# EAGLE design McPiFace-RGBPanel-V2 (EAGLE 7.4.0)
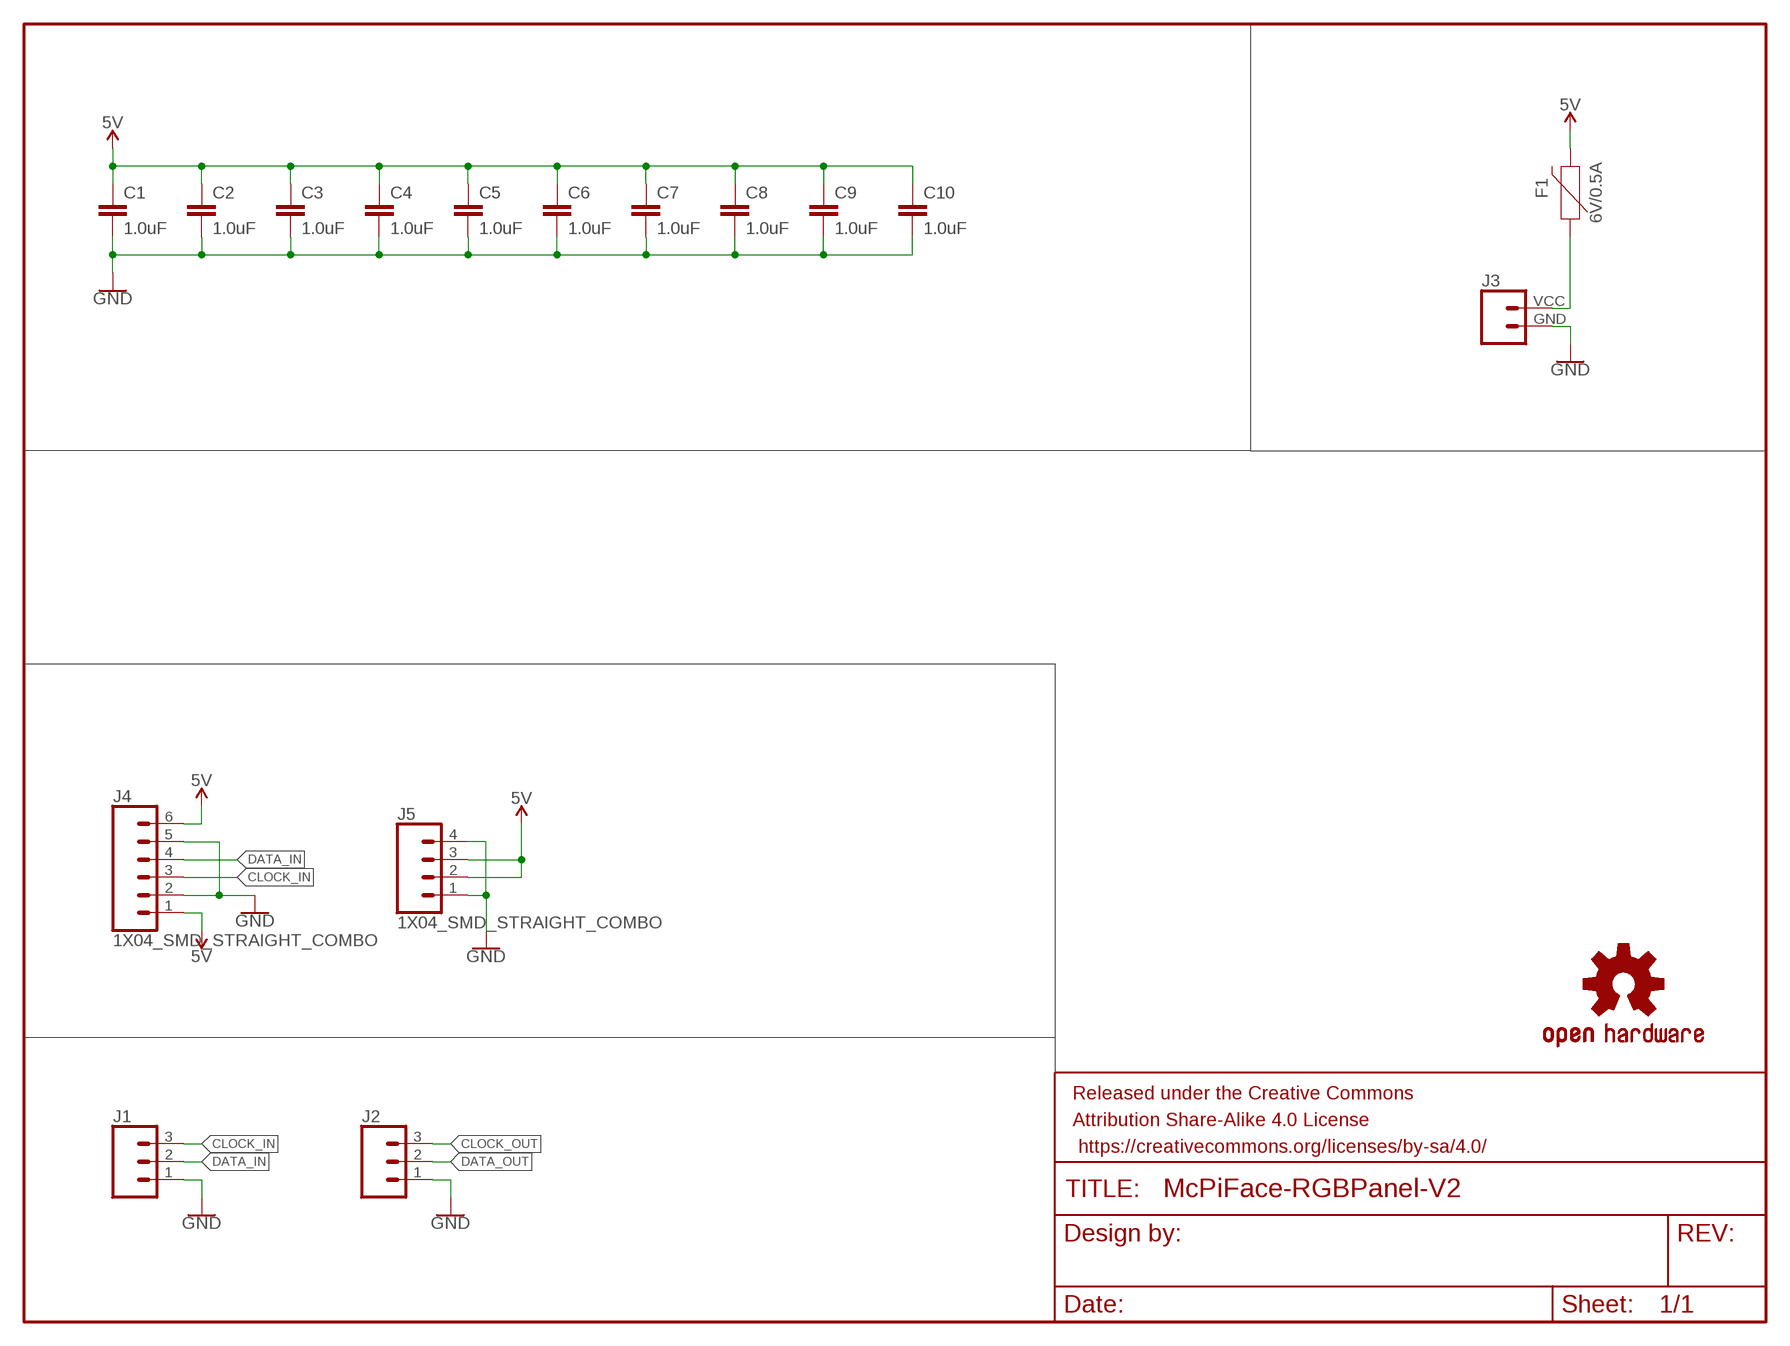
[diagram p0: schematic, sheet 1, part 1 of 2]
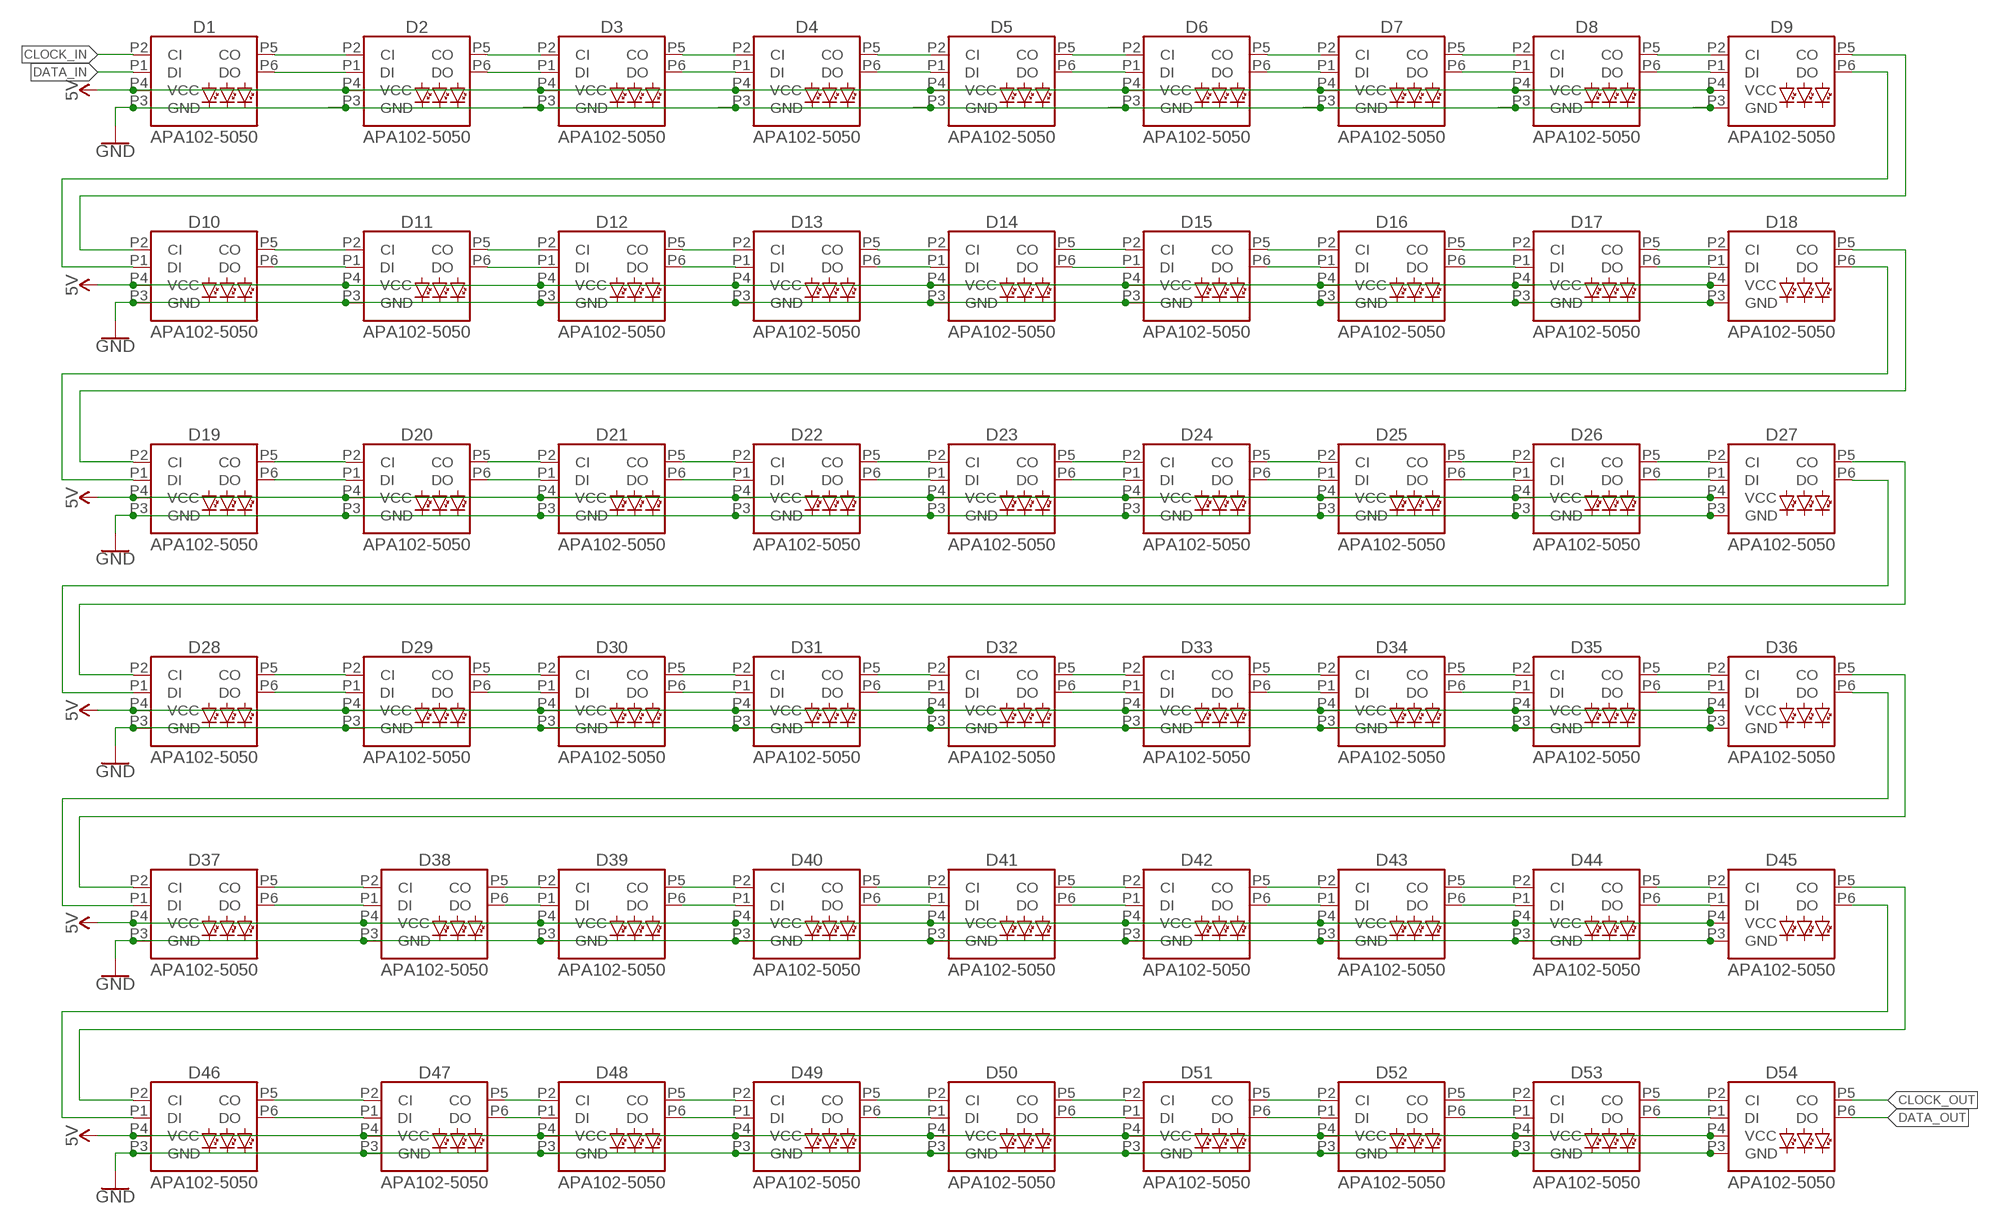
[diagram p1: schematic, sheet 1, part 2 of 2]

## Parts
C1  1.0uF  1.0UF-25V-+80/-20(0805)"  [0805-CAP]
C2  1.0uF  1.0UF-25V-+80/-20(0805)"  [0805-CAP]
C3  1.0uF  1.0UF-25V-+80/-20(0805)"  [0805-CAP]
C4  1.0uF  1.0UF-25V-+80/-20(0805)"  [0805-CAP]
C5  1.0uF  1.0UF-25V-+80/-20(0805)"  [0805-CAP]
C6  1.0uF  1.0UF-25V-+80/-20(0805)"  [0805-CAP]
C7  1.0uF  1.0UF-25V-+80/-20(0805)"  [0805-CAP]
C8  1.0uF  1.0UF-25V-+80/-20(0805)"  [0805-CAP]
C9  1.0uF  1.0UF-25V-+80/-20(0805)"  [0805-CAP]
C10  1.0uF  1.0UF-25V-+80/-20(0805)"  [0805-CAP]
D1  APA102-5050  [APA102-5050]
D2  APA102-5050  [APA102-5050]
D3  APA102-5050  [APA102-5050]
D4  APA102-5050  [APA102-5050]
D5  APA102-5050  [APA102-5050]
D6  APA102-5050  [APA102-5050]
D7  APA102-5050  [APA102-5050]
D8  APA102-5050  [APA102-5050]
D9  APA102-5050  [APA102-5050]
D10  APA102-5050  [APA102-5050]
D11  APA102-5050  [APA102-5050]
D12  APA102-5050  [APA102-5050]
D13  APA102-5050  [APA102-5050]
D14  APA102-5050  [APA102-5050]
D15  APA102-5050  [APA102-5050]
D16  APA102-5050  [APA102-5050]
D17  APA102-5050  [APA102-5050]
D18  APA102-5050  [APA102-5050]
D19  APA102-5050  [APA102-5050]
D20  APA102-5050  [APA102-5050]
D21  APA102-5050  [APA102-5050]
D22  APA102-5050  [APA102-5050]
D23  APA102-5050  [APA102-5050]
D24  APA102-5050  [APA102-5050]
D25  APA102-5050  [APA102-5050]
D26  APA102-5050  [APA102-5050]
D27  APA102-5050  [APA102-5050]
D28  APA102-5050  [APA102-5050]
D29  APA102-5050  [APA102-5050]
D30  APA102-5050  [APA102-5050]
D31  APA102-5050  [APA102-5050]
D32  APA102-5050  [APA102-5050]
D33  APA102-5050  [APA102-5050]
D34  APA102-5050  [APA102-5050]
D35  APA102-5050  [APA102-5050]
D36  APA102-5050  [APA102-5050]
D37  APA102-5050  [APA102-5050]
D38  APA102-5050  [APA102-5050]
D39  APA102-5050  [APA102-5050]
D40  APA102-5050  [APA102-5050]
D41  APA102-5050  [APA102-5050]
D42  APA102-5050  [APA102-5050]
D43  APA102-5050  [APA102-5050]
D44  APA102-5050  [APA102-5050]
D45  APA102-5050  [APA102-5050]
D46  APA102-5050  [APA102-5050]
D47  APA102-5050  [APA102-5050]
D48  APA102-5050  [APA102-5050]
D49  APA102-5050  [APA102-5050]
D50  APA102-5050  [APA102-5050]
D51  APA102-5050  [APA102-5050]
D52  APA102-5050  [APA102-5050]
D53  APA102-5050  [APA102-5050]
D54  APA102-5050  [APA102-5050]
F1  6V/0.5A  PPTC_HALF-AMP  [1206]
FRAME1  FRAME-LETTER  [CREATIVE_COMMONS]
J1  CONN_03SMD  [1X03-1MM-RA]
J2  CONN_03SMD  [1X03-1MM-RA]
J3  CONN_02JST-2-PH-VERT  [JST-2-SMD-VERT]
J4  1X04_SMD_STRAIGHT_COMBO  CONN_06SMD-STRAIGHT-COMBO-FEMALE  [1X06_SMD_STRAIGHT_COMBO]
J5  1X04_SMD_STRAIGHT_COMBO  CONN_04SMD_STRAIGHT_COMBO  [1X04_SMD_VERTICAL_COMBO]
LOGO1  OSHW-LOGOL  [OSHW-LOGO-L]

## Nets
5V: C1.1 C2.1 C3.1 C4.1 C5.1 C6.1 C7.1 C8.1 C9.1 C10.1 D1.P4(VCC) D2.P4(VCC) D3.P4(VCC) D4.P4(VCC) D5.P4(VCC) D6.P4(VCC) D7.P4(VCC) D8.P4(VCC) D9.P4(VCC) D10.P4(VCC) D11.P4(VCC) D12.P4(VCC) D13.P4(VCC) D14.P4(VCC) D15.P4(VCC) D16.P4(VCC) D17.P4(VCC) D18.P4(VCC) D19.P4(VCC) D20.P4(VCC) D21.P4(VCC) D22.P4(VCC) D23.P4(VCC) D24.P4(VCC) D25.P4(VCC) D26.P4(VCC) D27.P4(VCC) D28.P4(VCC) D29.P4(VCC) D30.P4(VCC) D31.P4(VCC) D32.P4(VCC) D33.P4(VCC) D34.P4(VCC) D35.P4(VCC) D36.P4(VCC) D37.P4(VCC) D38.P4(VCC) D39.P4(VCC) D40.P4(VCC) D41.P4(VCC) D42.P4(VCC) D43.P4(VCC) D44.P4(VCC) D45.P4(VCC) D46.P4(VCC) D47.P4(VCC) D48.P4(VCC) D49.P4(VCC) D50.P4(VCC) D51.P4(VCC) D52.P4(VCC) D53.P4(VCC) D54.P4(VCC) F1.2 J4.1 J4.6 J5.2 J5.3
CLOCK_IN: D1.P2(CI) J1.3 J4.3
CLOCK_OUT: D54.P5(CO) J2.3
DATA_IN: D1.P1(DI) J1.2 J4.4
DATA_OUT: D54.P6(DO) J2.2
GND: C1.2 C2.2 C3.2 C4.2 C5.2 C6.2 C7.2 C8.2 C9.2 C10.2 D1.P3(GND) D2.P3(GND) D3.P3(GND) D4.P3(GND) D5.P3(GND) D6.P3(GND) D7.P3(GND) D8.P3(GND) D9.P3(GND) D10.P3(GND) D11.P3(GND) D12.P3(GND) D13.P3(GND) D14.P3(GND) D15.P3(GND) D16.P3(GND) D17.P3(GND) D18.P3(GND) D19.P3(GND) D20.P3(GND) D21.P3(GND) D22.P3(GND) D23.P3(GND) D24.P3(GND) D25.P3(GND) D26.P3(GND) D27.P3(GND) D28.P3(GND) D29.P3(GND) D30.P3(GND) D31.P3(GND) D32.P3(GND) D33.P3(GND) D34.P3(GND) D35.P3(GND) D36.P3(GND) D37.P3(GND) D38.P3(GND) D39.P3(GND) D40.P3(GND) D41.P3(GND) D42.P3(GND) D43.P3(GND) D44.P3(GND) D45.P3(GND) D46.P3(GND) D47.P3(GND) D48.P3(GND) D49.P3(GND) D50.P3(GND) D51.P3(GND) D52.P3(GND) D53.P3(GND) D54.P3(GND) J1.1 J2.1 J3.GND J4.2 J4.5 J5.1 J5.4
N$1: D10.P5(CO) D11.P2(CI)
N$2: D10.P6(DO) D11.P1(DI)
N$3: D11.P5(CO) D12.P2(CI)
N$4: D11.P6(DO) D12.P1(DI)
N$5: F1.1 J3.VCC
N$6: D9.P5(CO) D10.P2(CI)
N$7: D9.P6(DO) D10.P1(DI)
N$8: D18.P6(DO) D19.P1(DI)
N$9: D18.P5(CO) D19.P2(CI)
N$10: D15.P5(CO) D16.P2(CI)
N$11: D15.P6(DO) D16.P1(DI)
N$12: D12.P5(CO) D13.P2(CI)
N$13: D12.P6(DO) D13.P1(DI)
N$14: D19.P6(DO) D20.P1(DI)
N$15: D16.P5(CO) D17.P2(CI)
N$16: D19.P5(CO) D20.P2(CI)
N$17: D16.P6(DO) D17.P1(DI)
N$18: D13.P5(CO) D14.P2(CI)
N$19: D13.P6(DO) D14.P1(DI)
N$20: D14.P6(DO) D15.P1(DI)
N$21: D14.P5(CO) D15.P2(CI)
N$22: D20.P6(DO) D21.P1(DI)
N$23: D1.P5(CO) D2.P2(CI)
N$24: D17.P5(CO) D18.P2(CI)
N$25: D17.P6(DO) D18.P1(DI)
N$26: D20.P5(CO) D21.P2(CI)
N$27: D21.P6(DO) D22.P1(DI)
N$28: D21.P5(CO) D22.P2(CI)
N$29: D22.P6(DO) D23.P1(DI)
N$30: D22.P5(CO) D23.P2(CI)
N$31: D23.P6(DO) D24.P1(DI)
N$32: D23.P5(CO) D24.P2(CI)
N$33: D24.P6(DO) D25.P1(DI)
N$34: D24.P5(CO) D25.P2(CI)
N$35: D25.P6(DO) D26.P1(DI)
N$36: D1.P6(DO) D2.P1(DI)
N$37: D25.P5(CO) D26.P2(CI)
N$38: D26.P6(DO) D27.P1(DI)
N$39: D26.P5(CO) D27.P2(CI)
N$42: D27.P5(CO) D28.P2(CI)
N$43: D27.P6(DO) D28.P1(DI)
N$44: D28.P6(DO) D29.P1(DI)
N$45: D28.P5(CO) D29.P2(CI)
N$46: D29.P6(DO) D30.P1(DI)
N$47: D29.P5(CO) D30.P2(CI)
N$48: D30.P6(DO) D31.P1(DI)
N$49: D30.P5(CO) D31.P2(CI)
N$50: D31.P6(DO) D32.P1(DI)
N$51: D31.P5(CO) D32.P2(CI)
N$52: D32.P6(DO) D33.P1(DI)
N$53: D32.P5(CO) D33.P2(CI)
N$54: D33.P6(DO) D34.P1(DI)
N$55: D33.P5(CO) D34.P2(CI)
N$56: D34.P6(DO) D35.P1(DI)
N$57: D34.P5(CO) D35.P2(CI)
N$58: D35.P6(DO) D36.P1(DI)
N$59: D35.P5(CO) D36.P2(CI)
N$62: D36.P5(CO) D37.P2(CI)
N$63: D36.P6(DO) D37.P1(DI)
N$64: D37.P6(DO) D38.P1(DI)
N$65: D37.P5(CO) D38.P2(CI)
N$66: D38.P6(DO) D39.P1(DI)
N$67: D38.P5(CO) D39.P2(CI)
N$68: D39.P6(DO) D40.P1(DI)
N$69: D39.P5(CO) D40.P2(CI)
N$70: D40.P6(DO) D41.P1(DI)
N$71: D40.P5(CO) D41.P2(CI)
N$72: D2.P5(CO) D3.P2(CI)
N$73: D2.P6(DO) D3.P1(DI)
N$74: D3.P5(CO) D4.P2(CI)
N$75: D3.P6(DO) D4.P1(DI)
N$76: D4.P5(CO) D5.P2(CI)
N$77: D4.P6(DO) D5.P1(DI)
N$78: D5.P5(CO) D6.P2(CI)
N$79: D5.P6(DO) D6.P1(DI)
N$80: D6.P5(CO) D7.P2(CI)
N$81: D6.P6(DO) D7.P1(DI)
N$82: D7.P5(CO) D8.P2(CI)
N$83: D7.P6(DO) D8.P1(DI)
N$84: D8.P5(CO) D9.P2(CI)
N$85: D8.P6(DO) D9.P1(DI)
N$86: D41.P6(DO) D42.P1(DI)
N$87: D41.P5(CO) D42.P2(CI)
N$88: D42.P6(DO) D43.P1(DI)
N$89: D42.P5(CO) D43.P2(CI)
N$90: D43.P6(DO) D44.P1(DI)
N$91: D43.P5(CO) D44.P2(CI)
N$92: D44.P6(DO) D45.P1(DI)
N$93: D44.P5(CO) D45.P2(CI)
N$94: D45.P6(DO) D46.P1(DI)
N$95: D45.P5(CO) D46.P2(CI)
N$98: D46.P6(DO) D47.P1(DI)
N$99: D46.P5(CO) D47.P2(CI)
N$100: D47.P6(DO) D48.P1(DI)
N$101: D47.P5(CO) D48.P2(CI)
N$102: D48.P6(DO) D49.P1(DI)
N$103: D48.P5(CO) D49.P2(CI)
N$104: D49.P6(DO) D50.P1(DI)
N$105: D49.P5(CO) D50.P2(CI)
N$106: D50.P6(DO) D51.P1(DI)
N$107: D50.P5(CO) D51.P2(CI)
N$108: D51.P6(DO) D52.P1(DI)
N$109: D51.P5(CO) D52.P2(CI)
N$110: D52.P6(DO) D53.P1(DI)
N$111: D52.P5(CO) D53.P2(CI)
N$112: D53.P6(DO) D54.P1(DI)
N$113: D53.P5(CO) D54.P2(CI)

## Library data of the parts
C1-C10 = SparkFun-Capacitors:1.0UF-25V-+80/-20(0805): CAP-11625; PROD_ID: CAP-11625
D1-D54 = SparkFun-LED:APA102: APA102 Addressable RGB LED Used in manufacturing of various products at SparkFun Packages: 5050 2020 SparkFun Products: SparkFun Lumenati Boards <https://www.sparkfun.com/categories/405>; PROD_ID: DIO-13739
F1 = SparkFun-Fuses:PPTC: Resettable Fuse PPTC Resettable Fuse. Really a sort of resistor with a polymeric positive temperature coefficient whose resistance increases dramatically with an increase in temperature. When heated by the power passing through the resistance rises causing the current to be limited, protecting the circuit. This is achieved by the transition of the polymer from a crystalline to an amorphous state where the conductive carbon separates breaking the conductive pathways found in the cool crystalline structure. When a PPTC cools back down it resumes conducting letting the circuit turn back on. SparkFun Products: SparkFun RedBoard - Programmed with Arduino <https://www.sparkfun.com/products/12757> Pro Micro - 5V/16MHz <https://www.sparkfun.com/products/12640> Arduino Pro 328 - 5V/16MHz <https://www.sparkfun.com/products/10915> MP3 Trigger <https://www.sparkfun.com/products/13720>; PROD_ID: RES-08585
FRAME1 = SparkFun-Aesthetics:FRAME-LETTER: Schematic Frame - Letter Standard 8.5x11 US Letter frame
J1 J2 = SparkFun-Connectors:CONN_03: Multi connection point. Often used as Generic Header-pin footprint for 0.1 inch spaced/style header connections On any of the 0.1 inch spaced packages, you can populate with these: Break Away Headers - Straight <https://www.sparkfun.com/products/116> (PRT-00116) Break Away Male Headers - Right Angle <https://www.sparkfun.com/products/553> (PRT-00553) Female Headers <https://www.sparkfun.com/products/115> (PRT-00115) Break Away Headers - Machine Pin <https://www.sparkfun.com/products/117> (PRT-00117) Break Away Female Headers - Swiss Machine Pin <https://www.sparkfun.com/products/743> (PRT-00743) Stackable Header - 3 Pin (Female, 0.1") <https://www.sparkfun.com/products/13875> (PRT-13875) For SCREWTERMINALS and SPRING TERMINALS visit here: Screw Terimnals on SparkFun.com <https://www.sparkfun.com/search/results?term=Screw+Terminals> (5mm/3.5mm/2.54mm spacing) This device is also useful as a general connection point to wire up your design to another part of your project. Our various solder wires solder well into these plated through hole pads. Hook-Up Wire - Assortment (Stranded, 22 AWG) <https://www.sparkfun.com/products/11375> (PRT-11375) Hook-Up Wire - Assortment (Solid Core, 22 AWG) <https://www.sparkfun.com/products/11367> (PRT-11367) View the entire wire category on our website here <https://www.sparkfun.com/categories/141> Special notes: Molex polarized connector foot print use with SKU : PRT-08232 with associated crimp pins and housings.
J3 = ThingySticks:CONN_02: Multi connection point. Often used as Generic Header-pin footprint for 0.1 inch spaced/style header connections On any of the 0.1 inch spaced packages, you can populate with these: Break Away Headers - Straight <https://www.sparkfun.com/products/116> (PRT-00116) Break Away Male Headers - Right Angle <https://www.sparkfun.com/products/553> (PRT-00553) Female Headers <https://www.sparkfun.com/products/115> (PRT-00115) Break Away Headers - Machine Pin <https://www.sparkfun.com/products/117> (PRT-00117) Break Away Female Headers - Swiss Machine Pin <https://www.sparkfun.com/products/743> (PRT-00743) For SCREWTERMINALS and SPRING TERMINALS visit here: Screw Terimnals on SparkFun.com <https://www.sparkfun.com/search/results?term=Screw+Terminals> (5mm/3.5mm/2.54mm spacing) This device is also useful as a general connection point to wire up your design to another part of your project. Our various solder wires solder well into these plated through hole pads. Hook-Up Wire - Assortment (Stranded, 22 AWG) <https://www.sparkfun.com/products/11375> (PRT-11375) Hook-Up Wire - Assortment (Solid Core, 22 AWG) <https://www.sparkfun.com/products/11367> (PRT-11367) View the entire wire category on our website here <https://www.sparkfun.com/categories/141> Special notes: Molex polarized connector foot print use with: PRT-08233 with associated crimp pins and housings. 2.54_SCREWTERM for use with PRT-10571. 3.5mm Screw Terminal footprints for PRT-08084 5mm Screw Terminal footprints for use with PRT-08432
J4 = SparkFun-Connectors:CONN_06: Multi connection point. Often used as Generic Header-pin footprint for 0.1 inch spaced/style header connections On any of the 0.1 inch spaced packages, you can populate with these: Break Away Headers - Straight <https://www.sparkfun.com/products/116> (PRT-00116) Break Away Male Headers - Right Angle <https://www.sparkfun.com/products/553> (PRT-00553) Female Headers <https://www.sparkfun.com/products/115> (PRT-00115) Break Away Headers - Machine Pin <https://www.sparkfun.com/products/117> (PRT-00117) Break Away Female Headers - Swiss Machine Pin <https://www.sparkfun.com/products/743> (PRT-00743) Arduino Stackable Header - 6 Pin <https://www.sparkfun.com/products/9280> (PRT-09280) For SCREWTERMINALS and SPRING TERMINALS visit here: Screw Terimnals on SparkFun.com <https://www.sparkfun.com/search/results?term=Screw+Terminals> (5mm/3.5mm/2.54mm spacing) This device is also useful as a general connection point to wire up your design to another part of your project. Our various solder wires solder well into these plated through hole pads. Hook-Up Wire - Assortment (Stranded, 22 AWG) <https://www.sparkfun.com/products/11375> (PRT-11375) Hook-Up Wire - Assortment (Solid Core, 22 AWG) <https://www.sparkfun.com/products/11367> (PRT-11367) View the entire wire category on our website here <https://www.sparkfun.com/categories/141>; PROD_ID: CONN-10203
J5 = SparkFun-Connectors:CONN_04: Multi connection point. Often used as Generic Header-pin footprint for 0.1 inch spaced/style header connections On any of the 0.1 inch spaced packages, you can populate with these: Break Away Headers - Straight <https://www.sparkfun.com/products/116> (PRT-00116) Break Away Male Headers - Right Angle <https://www.sparkfun.com/products/553> (PRT-00553) Female Headers <https://www.sparkfun.com/products/115> (PRT-00115) Break Away Headers - Machine Pin <https://www.sparkfun.com/products/117> (PRT-00117) Break Away Female Headers - Swiss Machine Pin <https://www.sparkfun.com/products/743> (PRT-00743) For SCREWTERMINALS and SPRING TERMINALS visit here: Screw Terimnals on SparkFun.com <https://www.sparkfun.com/search/results?term=Screw+Terminals> (5mm/3.5mm/2.54mm spacing) This device is also useful as a general connection point to wire up your design to another part of your project. Our various solder wires solder well into these plated through hole pads. Hook-Up Wire - Assortment (Stranded, 22 AWG) <https://www.sparkfun.com/products/11375> (PRT-11375) Hook-Up Wire - Assortment (Solid Core, 22 AWG) <https://www.sparkfun.com/products/11367> (PRT-11367) View the entire wire category on our website here <https://www.sparkfun.com/categories/141> Special notes: Molex polarized connector foot print use with SKU : PRT-08231 with associated crimp pins and housings. 1MM SMD Version SKU: PRT-10208; PROD_ID: CONN-08511
LOGO1 = SparkFun-Aesthetics:OSHW-LOGO: Open-Source Hardware (OSHW) Logo This logo indicates the piece of hardware it is found on incorporates a OSHW license and/or adheres to the definition of open source hardware found here: http://freedomdefined.org/OSHW

## Board
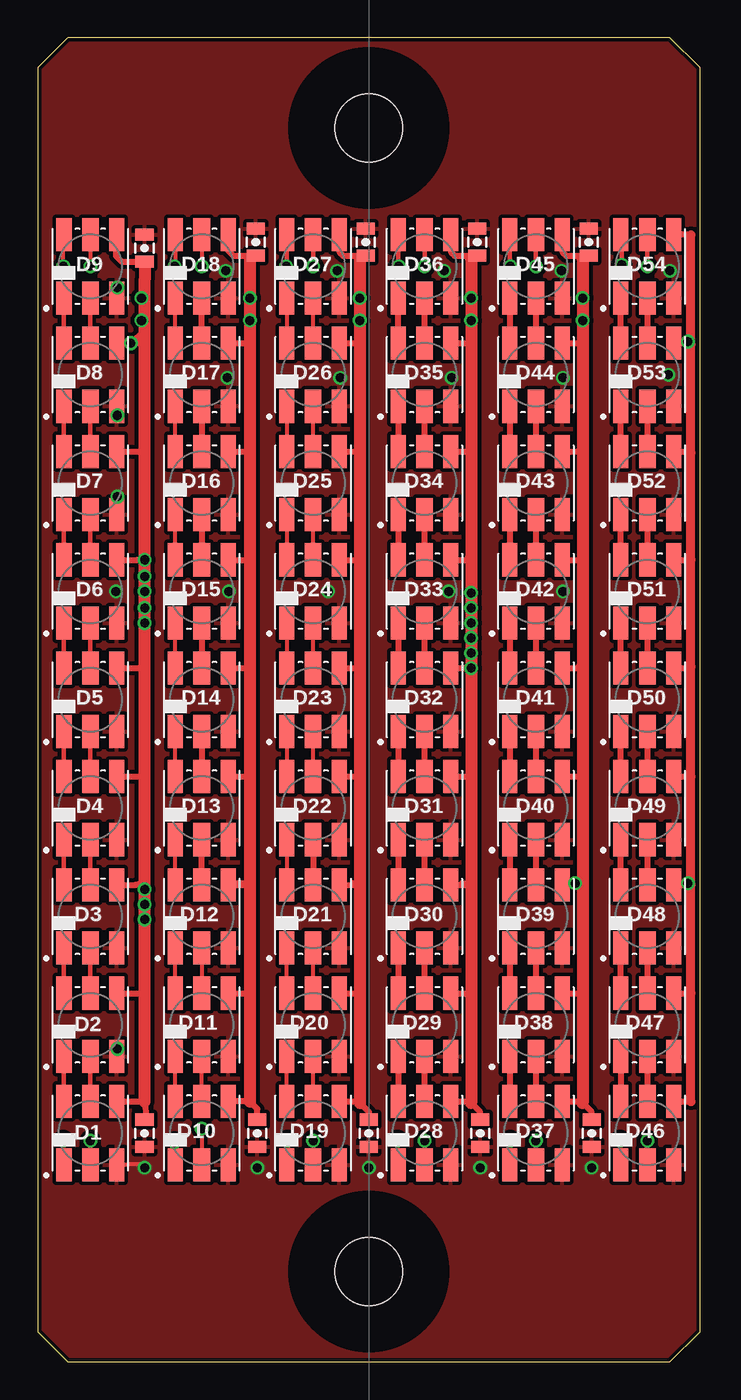
[diagram p2: board, top side]
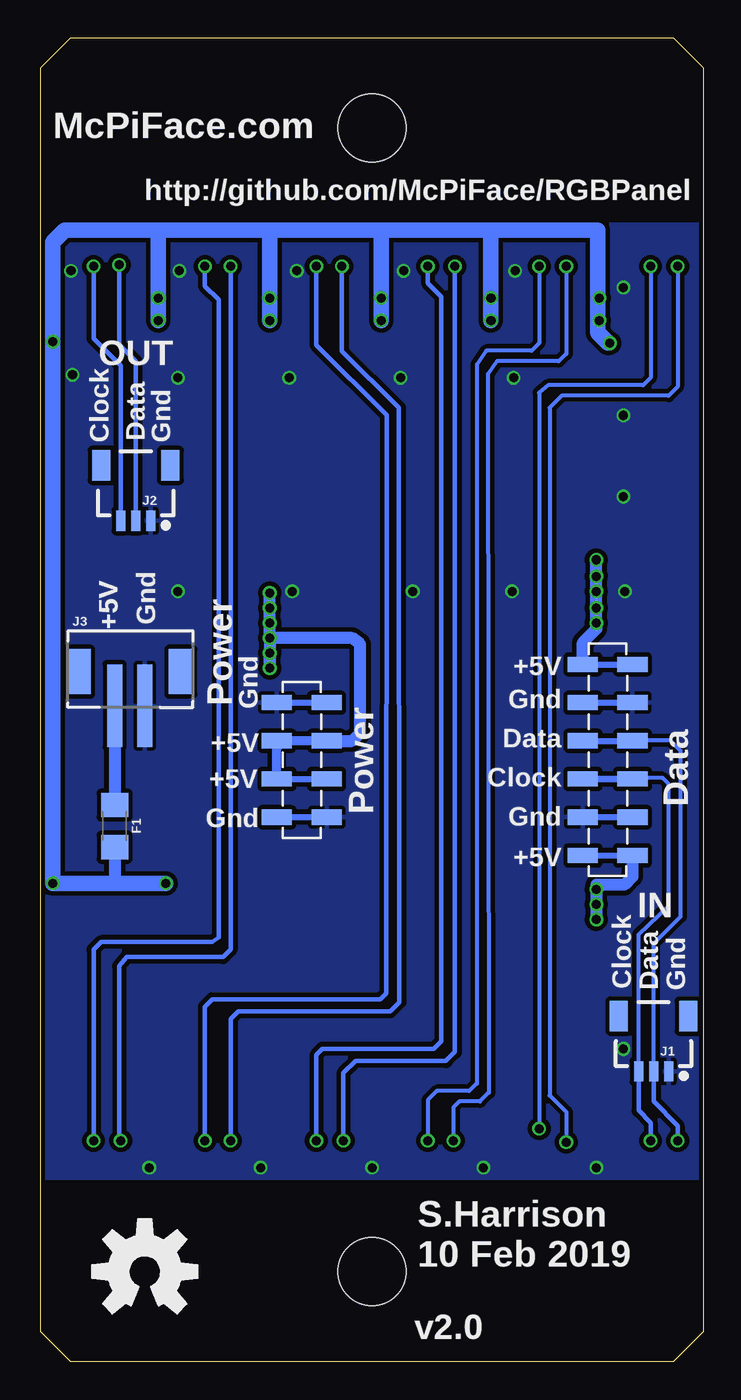
[diagram p3: board, bottom side, seen from below]

Size 44 x 88 mm. Coordinates in mm from the lower left corner, seen from the top.
Outline: 2,0 42,0 44,2 44,86 42,88 2,88 0,86 0,2 2,0
Copper layers (1*16): Top 0.035mm / dielectric 1.5mm / Bottom 0.035mm
Design rules "dirt_cheap_dirty_boards.v1.1": minimum track width 6mil, minimum drill 12mil, track to track 6mil, track to pad 6mil, pad to pad 6mil, via to via 6mil, smd to smd 0mil, copper to edge 10mil, drill to drill 10mil, minimum pad ring 10mil, minimum via ring 6mil, stop-mask expansion 2mil, vias tented up to drill 25mil, thermal gap 10mil
Holes 4.5 mm at 22,6 22,82
tRestrict: area 17,77 to 27,87; area 17,1 to 27,11
bRestrict: area 0,0 to 44,11.8; area 0,76 to 44,88

### Footprints (pad centres in the part's own frame; a part is rotated, then mirrored left to right if it is on the bottom)
0805-CAP = smd 0.8 x 1.2: 1 -0.9,0; 2 0.9,0
APA102-5050 = smd 1 x 2.2: P1 -1.75,-2.1; P3 1.75,-2.1; P4 1.75,2.1; P6 -1.75,2.1 | smd 1.1 x 2.2: P2 0,-2.1; P5 0,2.1
1206 = smd 1.6 x 1.8: 1 -1.4,0; 2 1.4,0
1X03-1MM-RA = smd 0.6 x 1.35: 1 -1,0; 2 0,0; 3 1,0 | smd 1.2 x 2: NC1 2.3,-3.675; NC2 -2.3,-3.675
JST-2-SMD-VERT = smd 1 x 5.5: GND 1,-2; VCC -1,-2 | smd 1.6 x 3: P$1 -3.4,0.27; P$2 3.4,0.27
1X06_SMD_STRAIGHT_COMBO = smd 1 x 2: 1 0,-1.65; 1-2 0,1.65; 2 2.54,1.65; 2-2 2.54,-1.65; 3 5.08,-1.65; 3-2 5.08,1.65; 4 7.62,1.65; 4-2 7.62,-1.65; 5 10.16,-1.65; 5-2 10.16,1.65; 6 12.7,1.65; 6-2 12.7,-1.65
1X04_SMD_VERTICAL_COMBO = smd 1 x 2: 1 0,-1.65; 1-2 0,1.65; 2 2.54,1.65; 2-2 2.54,-1.65; 3 5.08,-1.65; 3-2 5.08,1.65; 4 7.62,1.65; 4-2 7.62,-1.65

### Placement (x,y rotation side)
C1  29.4,15.2 270 top
C2  21.8,74.4 90 top
C3  29.2,74.4 90 top
C4  14.5,74.4 90 top
C5  14.6,15.2 270 top
C6  7.1,15.2 270 top
C7  22,15.2 270 top
C8  36.8,15.2 270 top
C9  7.1,74 90 top
C10  36.6,74.4 90 top
D1  3.5,15.2 0 top
D2  3.5,22.4 0 top
D3  3.5,29.6 0 top
D4  3.5,36.8 0 top
D5  3.5,44 0 top
D6  3.5,51.2 0 top
D7  3.5,58.4 0 top
D8  3.5,65.6 0 top
D9  3.5,72.8 0 top
D10  10.9,15.2 0 top
D11  10.9,22.4 0 top
D12  10.9,29.6 0 top
D13  10.9,36.8 0 top
D14  10.9,44 0 top
D15  10.9,51.2 0 top
D16  10.9,58.4 0 top
D17  10.9,65.6 0 top
D18  10.9,72.8 0 top
D19  18.3,15.2 0 top
D20  18.3,22.4 0 top
D21  18.3,29.6 0 top
D22  18.3,36.8 0 top
D23  18.3,44 0 top
D24  18.3,51.2 0 top
D25  18.3,58.4 0 top
D26  18.3,65.6 0 top
D27  18.3,72.8 0 top
D28  25.7,15.2 0 top
D29  25.7,22.4 0 top
D30  25.7,29.6 0 top
D31  25.7,36.8 0 top
D32  25.7,44 0 top
D33  25.7,51.2 0 top
D34  25.7,58.4 0 top
D35  25.7,65.6 0 top
D36  25.7,72.8 0 top
D37  33.1,15.2 0 top
D38  33.1,22.4 0 top
D39  33.1,29.6 0 top
D40  33.1,36.8 0 top
D41  33.1,44 0 top
D42  33.1,51.2 0 top
D43  33.1,58.4 0 top
D44  33.1,65.6 0 top
D45  33.1,72.8 0 top
D46  40.5,15.2 0 top
D47  40.5,22.4 0 top
D48  40.5,29.6 0 top
D49  40.5,36.8 0 top
D50  40.5,44 0 top
D51  40.5,51.2 0 top
D52  40.5,58.4 0 top
D53  40.5,65.6 0 top
D54  40.5,72.8 0 top
F1  39.1,35.6 270 bottom
FRAME1  -1.1,-9.7 0 top  (outside the outline)
J1  3.3,19.3 180 bottom
J2  37.7,55.9 180 bottom
J3  38.1,45.6 0 bottom
J4  6.35,33.66 90 bottom
J5  26.67,36.2 90 bottom
LOGO1  37.1,6 0 bottom

### Tracks (layer width: path | path; a pad name or v marks a point on that pad's centre or on a via)
5V  (via drill 0.6)
  Top 0.305: 7.1,71.9 7.1,72.1 | 5.2,74.4 5.25,74.55 D9.P4
  Top 0.406: 14.1,72.1 14.1,71.8 | D10.P4 14.1,17.3 14.6,16.8 C5.1 | D11.P4 14,24.5 14.1,24.6 | 14.1,31.6 14,31.7 D12.P4 12.75,31.8 13.6,31.8 | D13.P4 13.9,38.9 14.1,39.1 | D14.P4 14,46.1 14.1,46.2 | D15.P4 14.1,53.3 | D16.P4 14.1,60.5 | D17.P4 14,67.7 14.1,67.8 | D8.P4 v6.2,67.7 | v6.2,67.7 7.1,67.7 | D7.P4 7.1,60.5 | D6.P4 6.6,53.3 7.1,53.4 | D5.P4 7.1,46.1 | D4.P4 6.6,38.9 7.1,39 | D3.P4 6.5,31.7 7.1,31.9 | D2.P4 7.1,24.5 | D1.P4 7.1,17.3 | 21.4,73.3 21.33,72.19 21.52,71.7 21.5,73.2 C2.1 20.3,73.5 20.05,73.75 D27.P4 | D19.P4 21.3,17.3 21.4,17.2 22,16.6 C7.1 | D20.P4 21.3,24.5 21.4,24.4 | D21.P4 21.2,31.7 21.4,31.5 | D22.P4 21.3,38.9 21.4,38.8 | D23.P4 21.4,46.1 | D24.P4 21.3,53.3 21.4,53.4 | D25.P4 21.4,60.5 | D26.P4 21.2,67.7 21.4,67.9 | D46.P4 43.4,17.3 | 43.4,74.9 D54.P4 | D53.P4 43.3,67.7 | 43.3,67.7 43.4,67.6 | D52.P4 43.3,60.5 43.4,60.4 | D51.P4 43.4,53.3 | D50.P4 43.3,46.1 43.4,46.2 | D49.P4 43.4,38.9 | D48.P4 43.2,31.7 | 43.2,31.7 43.4,31.7 | D47.P4 43.4,24.5 | D37.P4 36.1,17.3 36.2,17.2 36.8,16.6 C8.1 | D38.P4 36.2,24.5 | D39.P4 35.7,31.7 | 35.7,31.7 36.1,31.7 36.2,31.8 | D40.P4 36.2,38.9 | D41.P4 36,46.1 36.2,46.3 | D42.P4 36.2,53.3 | D43.P4 36.1,60.5 36.2,60.6 | D44.P4 36.1,67.7 36.2,67.8 | D35.P4 28.8,67.7 | D34.P4 28.8,60.5 | D33.P4 28.6,53.3 28.8,53.5 | D32.P4 28.7,46.1 28.8,46 | D31.P4 28.7,38.9 28.8,39 | D30.P4 28.8,31.7 28.7,31.8 28.2,31.8 | D29.P4 28.6,24.5 28.8,24.3 | D28.P4 28.7,17.3 28.8,17.2 29.4,16.6 C1.1 | C6.1 7.2,16.5 7.1,17.9 | 28.8,73.3 C3.1 27.7,73.5 27.45,73.75 D36.P4 | 36.2,73.3 C10.1 35.1,73.5 34.85,73.75 D45.P4 | 14.1,73.4 C4.1 13,73.5 12.65,73.85 D18.P4 | 7.1,72.9 C9.1 5.6,73.1 5.2,73.5 5.2,74.4 | v6.9,70.7 6.9,71.1 7.1,71.3 | v6.9,69.2 7,69.1 7,68.5 v6.2,67.7
  Top 0.406: 43.3,67.7 v43.2,67.8 | v43.2,31.8 43.2,31.7 | v35.7,31.8 35.7,31.7 | 20.9,31.8 21.4,31.8
  Top 0.61: 43.4,17.3 43.4,24.5 43.4,31.7 43.4,38.9 43.4,46.2 43.4,53.3 43.4,60.4 43.4,67.6 43.4,74.9
  Top 0.813: 7.1,17.3 7.1,17.9 7.1,24.5 v7.1,29.4 v7.1,30.4 v7.1,31.4 7.1,31.9 7.1,39 7.1,46.1 v7.1,49.1 v7.1,50.1 v7.1,51.2 v7.1,52.2 v7.1,53.3 7.1,53.4 7.1,60.5 7.1,67.7 7.1,71.3 7.1,71.9 7.1,72.9 | 14.1,73.4 14.1,71.8 v14.1,70.7 v14.1,69.2 14.1,67.8 14.1,60.5 14.1,53.3 14.1,46.2 14.1,39.1 14.1,31.6 14.1,24.6 14.1,17.3 | 21.4,73.3 v21.4,70.7 v21.4,69.2 21.4,67.9 21.4,60.5 21.4,53.4 21.4,46.1 21.4,38.8 21.4,31.8 21.4,31.5 21.4,24.4 21.4,17.2 | 28.8,73.3 v28.8,70.7 v28.8,69.2 28.8,67.7 28.8,60.5 28.8,53.5 v28.8,46.1 | v28.8,46.1 28.8,46 28.8,39 28.8,31.7 28.8,24.3 28.8,17.2 | 36.2,73.3 v36.2,70.7 36.2,67.8 36.2,60.6 36.2,53.3 36.2,46.3 36.2,38.9 36.2,31.8 36.2,24.5 36.2,17.2 | 28.7,46.1 v28.8,46.1
  Bottom 0.406: 7,68.5 7,69.1 v6.9,69.2
  Bottom 0.61: J5.2 28.32,40.78 27.8,41.3 25.05,41.3 J5.3
  Bottom 0.813: F1.2 39.1,31.8 | v28.8,48.1 v28.8,47.1 | v28.8,48.1 v28.8,49.1 v28.8,50.1 v28.8,51.1 | v28.8,47.1 v28.8,46.1 | 28.8,46.4 v28.8,47.1 | J5.3 23.32,41.27 22.8,41.8 22.8,47.7 23.3,48.1 v28.8,48.1 | J4.6 8,47.8 7.1,48.7 v7.1,49.1 v7.1,50.1 v7.1,51.2 v7.1,52.2 v7.1,53.3 | J4.1 4.7,32.25 D3.P4 7.1,31.7 v7.1,31.4 v7.1,30.4 v7.1,29.4
  Bottom 1.016: v35.7,31.8 39.1,31.8 v43.2,31.8 43.2,74.4 42.4,75.2 36.2,75.2 | 36.2,75.2 28.8,75.2 | 28.8,75.2 21.4,75.2 | 21.4,75.2 14.1,75.2 | 14.1,75.2 7,75.2 7,68.5 7,68.4 6.3,67.7 | v36.2,69.2 36.2,75.2 | v28.8,69.2 28.8,75.2 | v21.4,69.2 21.4,75.2 | v14.1,69.2 14.1,75.2
CLOCK_IN  (via drill 0.6)
  Top 0.305: v3.5,14.7 D1.P2
  Bottom 0.254: J1.3 4.3,28.4 2.3,30.3 2.3,38.4 2.7,38.8 7.93,38.8 J4.3
  Bottom 0.305: J1.3 4.3,16.7 3.5,15.9 v3.5,14.7
CLOCK_OUT  (via drill 0.6)
  Top 0.305: v40.5,72.8 D54.P5
  Bottom 0.305: J2.3 38.7,66.2 40.5,68 v40.5,72.8
DATA_IN  (via drill 0.6)
  Top 0.305: v1.7,14.7 1.7,13.15 D1.P1
  Bottom 0.254: J1.2 3.3,27.8 1.5,29.6 1.5,40.6 2.2,41.3 4.67,41.3 J4.4
  Bottom 0.305: J1.2 3.3,17.3 1.7,15.7 v1.7,14.7
DATA_OUT  (via drill 0.6)
  Top 0.305: v38.8,72.9 38.8,74.85 D54.P6
  Bottom 0.305: J2.2 37.7,66.5 38.8,67.6 v38.8,72.9
GND  (via drill 0.6)
  Top 0.305: D2.P3 5.35,20.55 v5.3,20.8 | D1.P3 6.85,13.15 6.8,13.1
  other vias: 5.2,51.2 5.3,57.5 5.3,71.4 5.3,62.9 12.6,65.4 20.1,65.4 27.5,65.4 34.9,65.4 41.9,65.6 34.8,72.5 42,72.5 27,72.5 19.9,72.5 12.5,72.5 14.6,12.9 7.1,12.9 22,12.9 29.4,12.9 36.8,12.9 12.7,51.2 19.3,51.2 27.3,51.2 34.9,51.2
  pour Bottom (isolate 0.305, rank 2): -1,88.5 45,88.5 45,-1 -1,-1
  pour Top (isolate 0.254, rank 4): 44.5,88.3 44.5,0.1 44.6,0 -0.5,0 -0.5,88.2 -0.4,88.3
N$1
  Top 0.254: D10.P5 D11.P2
N$2
  Top 0.254: D10.P6 D11.P1
N$3
  Top 0.254: D12.P2 D11.P5
N$4
  Top 0.254: D11.P6 D12.P1
N$5
  Bottom 0.813: J3.VCC F1.1
N$6  (via drill 0.6)
  Top 0.254: D9.P5 v3.5,72.8 | v10.9,15.5 D10.P2
  Bottom 0.254: v3.5,72.8 3.5,65.4 4,64.9 10.3,64.9 10.9,64.4 v10.9,15.5
N$7  (via drill 0.6)
  Top 0.254: v1.7,72.8 1.7,74.85 D9.P6 | v9.1,14.6 9.1,13.15 D10.P1
  Bottom 0.254: v1.7,72.8 1.7,64.8 2.3,64.2 9.4,64.2 10.2,63.4 10.2,17.7 9.1,16.6 v9.1,14.6
N$8  (via drill 0.6)
  Top 0.254: D18.P6 9.15,72.95 v9.1,72.8 | v16.6,14.7 16.6,13.15 D19.P1
  Bottom 0.254: v9.1,72.8 9.1,67 9.6,66.5 13.7,66.5 13.71,66.5 14.3,65.64 14.24,17.9 14.85,17.3 16.2,17.3 16.6,16.9 v16.6,14.7
N$9  (via drill 0.6)
  Top 0.254: D18.P5 v10.9,72.8 | v18.3,14.7 D19.P2
  Bottom 0.254: v10.9,72.8 10.9,67.7 11.4,67.2 14.4,67.2 14.44,67.16 15.04,66.28 15.04,18.5 15.54,18 17.7,18 18.3,17.4 v18.3,14.7
N$10
  Top 0.406: D16.P2 D15.P5
N$11
  Top 0.254: D15.P6 D16.P1
N$12
  Top 0.406: D12.P5 D13.P2
N$13
  Top 0.254: D12.P6 D13.P1
N$14
  Top 0.254: D19.P6 D20.P1
N$15
  Top 0.406: D17.P2 D16.P5
N$16
  Top 0.254: D19.P5 D20.P2
N$17
  Top 0.254: D16.P6 D17.P1
N$18
  Top 0.406: D14.P2 D13.P5
N$19
  Top 0.254: D13.P6 D14.P1
N$20
  Top 0.254: D14.P6 D15.P1
N$21
  Top 0.406: D15.P2 D14.P5
N$22
  Top 0.254: D20.P6 16.55,26.95 16.5,27 16.5,27.45 D21.P1
N$23
  Top 0.305: D1.P5 D2.P2
N$24
  Top 0.406: D17.P5 D18.P2
N$25
  Top 0.254: D17.P6 D18.P1
N$26
  Top 0.254: D20.P5 D21.P2
N$27
  Top 0.254: D22.P1 D21.P6
N$28
  Top 0.406: D22.P2 D21.P5
N$29
  Top 0.254: D23.P1 D22.P6
N$30
  Top 0.254: D22.P5 D23.P2
N$31
  Top 0.254: D24.P1 D23.P6
N$32
  Top 0.254: D23.P5 D24.P2
N$33
  Top 0.254: D25.P1 D24.P6
N$34
  Top 0.254: D24.P5 D25.P2
N$35
  Top 0.254: D26.P1 D25.P6
N$36
  Top 0.305: D1.P6 D2.P1
N$37
  Top 0.254: D25.P5 D26.P2
N$38
  Top 0.254: D27.P1 D26.P6
N$39
  Top 0.254: D26.P5 D27.P2
N$42  (via drill 0.6)
  Top 0.305: D27.P5 v18.3,72.8 | v25.7,14.7 D28.P2
  Bottom 0.305: v18.3,72.8 18.3,71.7 17.4,70.8 17.4,21.3 17.9,20.8 25.3,20.8 25.7,20.4 v25.7,14.7
N$43  (via drill 0.6)
  Top 0.305: D27.P6 16.55,72.95 v16.5,72.8 | v23.9,14.7 23.9,13.15 D28.P1
  Bottom 0.305: v16.5,72.8 16.5,20.6 17.1,20 23.1,20 23.9,19.2 v23.9,14.7
N$44
  Top 0.406: D29.P1 D28.P6
N$45
  Top 0.406: D28.P5 D29.P2
N$46
  Top 0.406: D30.P1 D29.P6
N$47
  Top 0.406: D29.P5 D30.P2
N$48
  Top 0.406: D31.P1 D30.P6
N$49
  Top 0.406: D30.P5 D31.P2
N$50
  Top 0.406: D32.P1 23.95,39.65 24,39.6 24,38.95 D31.P6
N$51
  Top 0.406: D31.P5 D32.P2
N$52
  Top 0.406: D33.P1 D32.P6
N$53
  Top 0.406: D32.P5 D33.P2
N$54
  Top 0.406: D34.P1 D33.P6
N$55
  Top 0.406: D33.P5 D34.P2
N$56
  Top 0.406: D35.P1 D34.P6
N$57
  Top 0.406: D34.P5 D35.P2
N$58
  Top 0.406: D35.P6 D36.P1
N$59
  Top 0.406: D35.P5 D36.P2
N$62  (via drill 0.6)
  Top 0.305: D36.P5 v25.7,72.8 | v33.1,14.7 D37.P2
  Bottom 0.305: v25.7,72.8 25.7,67.58 21.02,62.9 21.05,24.5 21.45,24.1 32.6,24.1 33.1,23.6 v33.1,14.7
N$63  (via drill 0.6)
  Top 0.305: D36.P6 23.95,72.95 v24,72.8 | v31.4,14.7 31.4,13.15 D37.P1
  Bottom 0.305: v24,72.8 24,67.18 20.22,63.4 20.19,23.9 20.79,23.3 30.9,23.3 31.4,22.8 v31.4,14.7
N$64
  Top 0.406: D38.P1 31.35,18.05 31.4,18 31.4,17.35 D37.P6
N$65
  Top 0.406: D38.P2 D37.P5
N$66
  Top 0.406: D39.P1 D38.P6
N$67
  Top 0.406: D39.P2 D38.P5
N$68
  Top 0.406: D40.P1 D39.P6
N$69
  Top 0.406: D40.P2 D39.P5
N$70
  Top 0.406: D41.P1 D40.P6
N$71
  Top 0.406: D41.P2 D40.P5
N$72
  Top 0.305: D3.P2 D2.P5
N$73
  Top 0.305: D2.P6 D3.P1
N$74
  Top 0.305: D4.P2 D3.P5
N$75
  Top 0.305: D4.P1 D3.P6
N$76
  Top 0.305: D5.P2 D4.P5
N$77
  Top 0.305: D4.P6 D5.P1
N$78
  Top 0.305: D5.P5 D6.P2
N$79
  Top 0.305: D5.P6 D6.P1
N$80
  Top 0.305: D6.P5 D7.P2
N$81
  Top 0.305: D6.P6 D7.P1
N$82
  Top 0.305: D7.P5 D8.P2
N$83
  Top 0.305: D7.P6 D8.P1
N$84
  Top 0.305: D8.P5 D9.P2
N$85
  Top 0.305: D8.P6 D9.P1
N$86
  Top 0.406: D42.P1 D41.P6
N$87
  Top 0.406: D42.P2 D41.P5
N$88
  Top 0.406: D43.P1 D42.P6
N$89
  Top 0.406: D43.P2 D42.P5
N$90
  Top 0.406: D44.P1 D43.P6
N$91
  Top 0.406: D44.P2 D43.P5
N$92
  Top 0.406: D45.P1 D44.P6
N$93
  Top 0.406: D45.P2 D44.P5
N$94  (via drill 0.6)
  Top 0.305: D45.P6 31.35,72.85 v31.4,72.8 | v38.7,14.7 38.7,13.15 D46.P1
  Bottom 0.305: v31.4,72.8 31.4,27.4 31.9,26.9 38.3,26.9 38.8,26.3 38.8,14.85 38.75,14.8 38.75,14.55 v38.7,14.7
N$95  (via drill 0.6)
  Top 0.305: D45.P5 v33.1,72.8 | v40.5,14.7 40.4,13.2 D46.P2
  Bottom 0.305: v33.1,72.8 33.1,71.5 32.2,70.6 32.2,28.2 32.6,27.9 40,27.9 40.5,27.4 v40.5,14.7
N$98
  Top 0.406: D47.P1 D46.P6
N$99
  Top 0.406: D47.P2 D46.P5
N$100
  Top 0.406: D47.P6 D48.P1
N$101
  Top 0.406: D48.P2 D47.P5
N$102
  Top 0.406: D48.P6 D49.P1
N$103
  Top 0.406: D49.P2 D48.P5
N$104
  Top 0.406: D49.P6 D50.P1
N$105
  Top 0.406: D50.P2 D49.P5
N$106
  Top 0.406: D50.P6 D51.P1
N$107
  Top 0.406: D51.P2 D50.P5
N$108
  Top 0.406: D51.P6 D52.P1
N$109
  Top 0.406: D52.P2 D51.P5
N$110
  Top 0.406: D52.P6 D53.P1
N$111
  Top 0.406: D53.P2 D52.P5
N$112
  Top 0.406: D53.P6 D54.P1
N$113
  Top 0.406: D54.P2 D53.P5

### Text on the board
bNames: McPiFace.com | http://github.com/McPiFace/RGBPanel | OUT | Gnd | Data | Clock | Gnd | +5V | +5V | +5V | Gnd | Power | Gnd | Data | +5V | Clock | +5V | Data | Gnd | Gnd | Power | +5V | IN | Gnd | Data | Clock | S.Harrison / 10 Feb 2019 | v2.0